# Altium schematic sheet Mcu.SchDoc
size A3; SheetNumber: 4; SheetTotal: 5
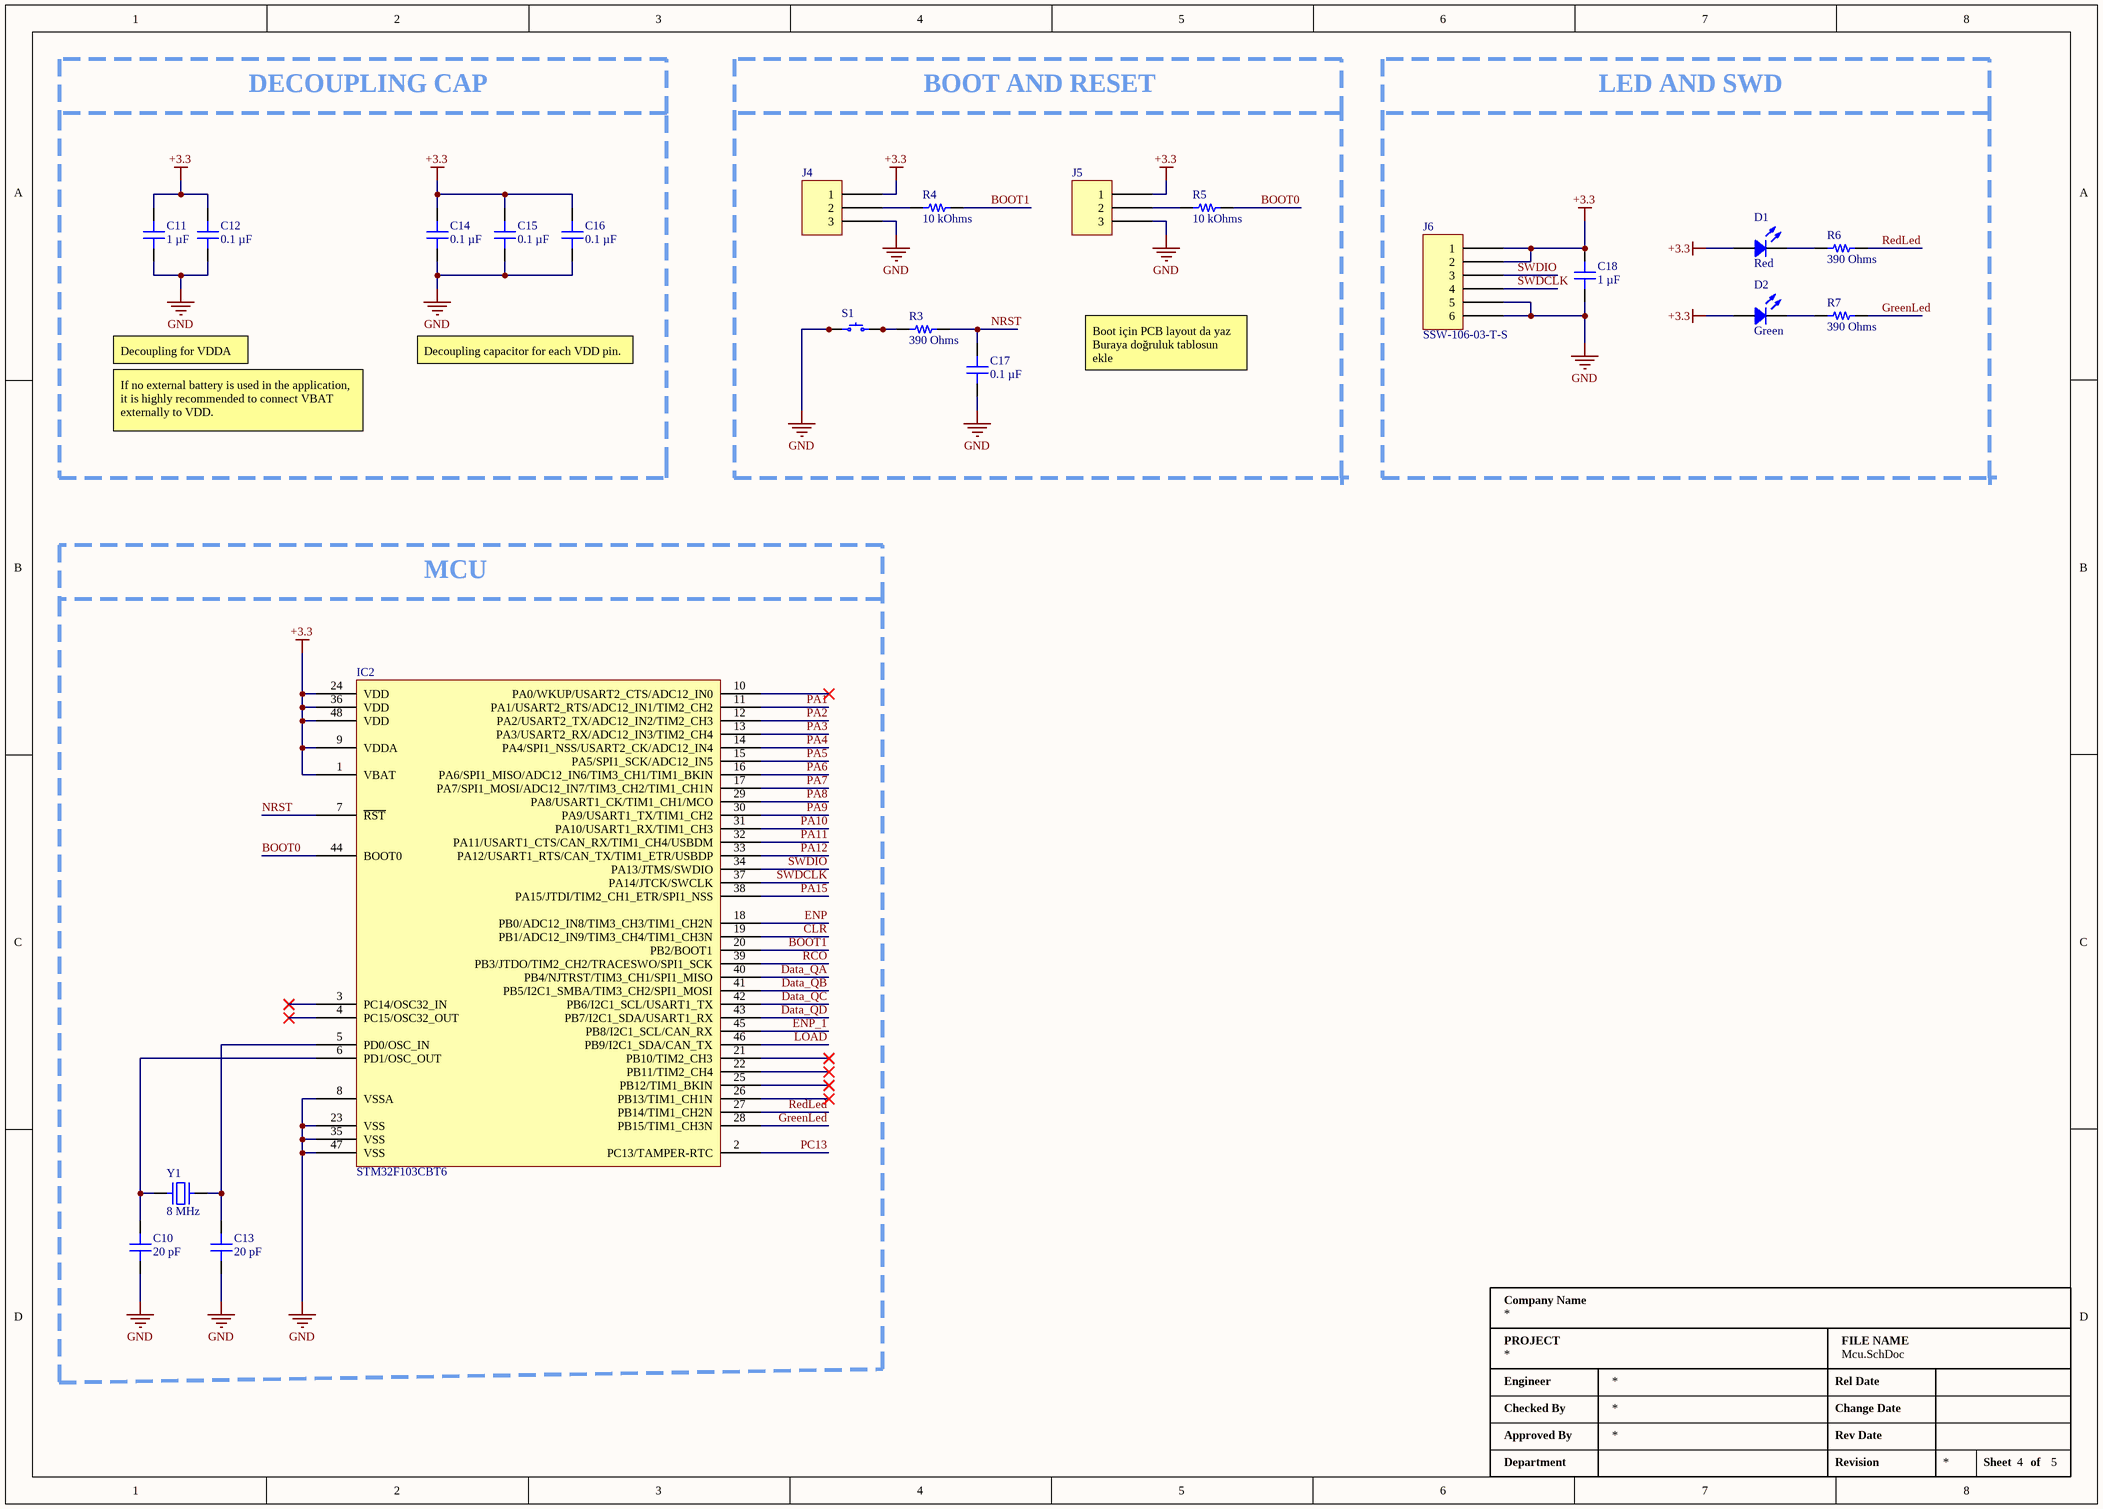
[diagram p0: Mcu.SchDoc]

## Parts
C10  20 pF  [CAP 0805_2012]
C11  1 µF  [CAP 0603_1608]
C12  0.1 µF  [CAP 0805_2012]
C13  20 pF  [CAP 0805_2012]
C14  0.1 µF  [CAP 0805_2012]
C15  0.1 µF  [CAP 0805_2012]
C16  0.1 µF  [CAP 0805_2012]
C17  0.1 µF  [CAP 0805_2012]
C18  1 µF  [CAP 0603_1608]
D1  Red  [LED 0805_2012 RED]
D2  Green  [LED 0805_2012 RED]
IC2  STM32F103CBT6  [ST LQFP-48 7X7MM]
J4  61300311121  [WURTH WE-PHD 61300311121]  (value not drawn)
J5  61300311121  [WURTH WE-PHD 61300311121]  (value not drawn)
J6  SSW-106-03-T-S  [SAMTEC SSW-106-03-T-S]
R3  390 Ohms  [KOA RES RK73 RN73 0603_1608]
R4  10 kOhms  [YAGEO RES 0603_1608]
R5  10 kOhms  [YAGEO RES 0603_1608]
R6  390 Ohms  [KOA RES RK73 RN73 0603_1608]
R7  390 Ohms  [KOA RES RK73 RN73 0603_1608]
S1  PTS645SM43SMTR92 LFS  [C&K PTS645]  (value not drawn)
Y1  8 MHz  [NDK NX5032GA]

## Blocks framed on the sheet
DECOUPLING CAP: C11 C12 C14-C16
MCU: C10 C13 IC2 Y1

## Nets
+3.3: C11.2 C12.2 C14.2 C15.2 C16.2 C18.2 D1.1 D2.1 IC2.1(VBAT) IC2.9(VDDA) IC2.24(VDD) IC2.36(VDD) IC2.48(VDD) J4.1 J5.1 J6.1 J6.2
GND: C10.1 C11.1 C12.1 C13.1 C14.1 C15.1 C16.1 C17.2 C18.1 IC2.8(VSSA) IC2.23(VSS) IC2.35(VSS) IC2.47(VSS) J4.3 J5.3 J6.5 J6.6 S1.1 S1.2
BOOT0: IC2.44(BOOT0) R5.2
BOOT1: IC2.20(PB2/BOOT1) R4.2
CLR: IC2.19(PB1/ADC12_IN9/TIM3_CH4/TIM1_CH3N)
Data_QA: IC2.40(PB4/NJTRST/TIM3_CH1/SPI1_MISO)
Data_QB: IC2.41(PB5/I2C1_SMBA/TIM3_CH2/SPI1_MOSI)
Data_QC: IC2.42(PB6/I2C1_SCL/USART1_TX)
Data_QD: IC2.43(PB7/I2C1_SDA/USART1_RX)
ENP: IC2.18(PB0/ADC12_IN8/TIM3_CH3/TIM1_CH2N)
ENP_1: IC2.45(PB8/I2C1_SCL/CAN_RX)
GreenLed: IC2.28(PB15/TIM1_CH3N) R7.1
LOAD: IC2.46(PB9/I2C1_SDA/CAN_TX)
NRST: C17.1 IC2.7(~{RST}) R3.2
PA1: IC2.11(PA1/USART2_RTS/ADC12_IN1/TIM2_CH2)
PA2: IC2.12(PA2/USART2_TX/ADC12_IN2/TIM2_CH3)
PA3: IC2.13(PA3/USART2_RX/ADC12_IN3/TIM2_CH4)
PA4: IC2.14(PA4/SPI1_NSS/USART2_CK/ADC12_IN4)
PA5: IC2.15(PA5/SPI1_SCK/ADC12_IN5)
PA6: IC2.16(PA6/SPI1_MISO/ADC12_IN6/TIM3_CH1/TIM1_BKIN)
PA7: IC2.17(PA7/SPI1_MOSI/ADC12_IN7/TIM3_CH2/TIM1_CH1N)
PA8: IC2.29(PA8/USART1_CK/TIM1_CH1/MCO)
PA9: IC2.30(PA9/USART1_TX/TIM1_CH2)
PA10: IC2.31(PA10/USART1_RX/TIM1_CH3)
PA11: IC2.32(PA11/USART1_CTS/CAN_RX/TIM1_CH4/USBDM)
PA12: IC2.33(PA12/USART1_RTS/CAN_TX/TIM1_ETR/USBDP)
PA15: IC2.38(PA15/JTDI/TIM2_CH1_ETR/SPI1_NSS)
PC13: IC2.2(PC13/TAMPER-RTC)
RCO: IC2.39(PB3/JTDO/TIM2_CH2/TRACESWO/SPI1_SCK)
RedLed: IC2.27(PB14/TIM1_CH2N) R6.1
SWDCLK: IC2.37(PA14/JTCK/SWCLK) J6.4
SWDIO: IC2.34(PA13/JTMS/SWDIO) J6.3
NetC10_2: C10.2 IC2.6(PD1/OSC_OUT) Y1.2
NetC13_2: C13.2 IC2.5(PD0/OSC_IN) Y1.1
NetD1_2: D1.2 R6.2
NetD2_2: D2.2 R7.2
NetJ4_2: J4.2 R4.1
NetJ5_2: J5.2 R5.1
NetR3_1: R3.1 S1.3 S1.4

Not connected (* = marked no-connect by the designer): IC2 3(PC14/OSC32_IN)* 4(PC15/OSC32_OUT)* 10(PA0/WKUP/USART2_CTS/ADC12_IN0)* 21(PB10/TIM2_CH3)* 22(PB11/TIM2_CH4)* 25(PB12/TIM1_BKIN)* 26(PB13/TIM1_CH1N)*

## Notes on the sheet
- BOOT AND RESET
- LED AND SWD
- Decoupling for VDDA
- Decoupling capacitor for each VDD pin.
- Boot için PCB layout da yaz
  Buraya doğruluk tablosun ekle
- If no external battery is used in the application, it is highly recommended to connect VBAT
  externally to VDD.
- Company Name
- Engineer
- PROJECT
- Rel Date
- FILE NAME
- Checked By
- Approved By
- Rev Date
- Change Date
- Department
- Revision
- Sheet
- of

## Library data of the parts
C10 C13 = C0805C200F5GAC7800: CAP CER SMD 0805 20PF 50V 1% COG; manufacturer: KEMET; Temperature Coefficient: C0G, NP0; Part Number: C0805C200F5GAC7800; Capacitance: 20 pF; Applications: General Purpose; componentlink1description: Datasheet; componentlink1url: https://api.kemet.com/component-edge/download/datasheet/C0805C200F5GAC7800.pdf; componentlink2description: DigiKey Link; componentlink2url: https://www.digikey.com/en/products/detail/kemet/C0805C200F5GAC7800/8572458; Device Package: 0805 (2012 Metric); Features: Low ESL; lastupdated: 9.02.2024 20:15:38; Lifecycle Status: Active; Minimum Order: 1; Mounting Type: Surface Mount, MLCC; Operating Temperature: -55°C ~ 125°C; Package / Case: 0805 (2012 Metric); packaging: TapeAndReel; partid: 13880; Part Status: Active; price: 0.32; series: SMD Comm C0G; Size / Dimension: 0.079" L x 0.049" W (2.00mm x 1.25mm); Supplier 1: DigiKey; Supplier Part Number 1: 399-17623-1-ND; Thickness (Max): 0.035" (0.88mm); Tolerance: ±1%; value: 20 pF; Voltage - Rated: 50V
C11 C18 = C0603X105M4RAC7867: CAP CER 0603 1UF 16V X7R 20%; manufacturer: KEMET; Part Number: C0603X105M4RAC7867; Capacitance: 1 µF; Applications: Boardflex Sensitive; componentlink1description: Datasheet; componentlink1url: https://api.kemet.com/component-edge/download/datasheet/C0603X105M4RAC7867.pdf; componentlink2description: DigiKey Link; componentlink2url: https://www.digikey.com/en/products/detail/kemet/C0603X105M4RAC7867/8635843; Device Package: 0603 (1608 Metric); Features: Soft Termination; lastupdated: 9.02.2024 20:10:28; Lifecycle Status: Active; Minimum Order: 1; Mounting Type: Surface Mount, MLCC; Operating Temperature: -55°C ~ 125°C; Package / Case: 0603 (1608 Metric); packaging: TapeAndReel; partid: 3937; Part Status: Active; price: 0.05; series: SMD Comm X7R Flex; Size / Dimension: 0.063" L x 0.031" W (1.60mm x 0.80mm); Supplier 1: DigiKey; Supplier Part Number 1: 399-17716-1-ND; Temperature Coefficient: X7R; Thickness (Max): 0.037" (0.95mm); Tolerance: ±20%; value: 1 µF; Voltage - Rated: 16V
C12 C14-C17 = C0805C104J1RECAUTO: CAP CER 0805 0.1UF 100V X7R 5%; manufacturer: KEMET; Part Number: C0805C104J1RECAUTO; Capacitance: 0.1 µF; Applications: Automotive, ESD Protection; componentlink1description: Datasheet; componentlink1url: https://api.kemet.com/component-edge/download/datasheet/C0805C104J1RECAUTO.pdf; componentlink2description: DigiKey Link; componentlink2url: https://www.digikey.com/en/products/detail/kemet/C0805C104J1RECAUTO/8646637; Device Package: 0805 (2012 Metric); lastupdated: 9.02.2024 20:15:06; Lifecycle Status: Active; Minimum Order: 1; Mounting Type: Surface Mount, MLCC; Operating Temperature: -55°C ~ 125°C; Package / Case: 0805 (2012 Metric); packaging: TapeAndReel; partid: 31979; Part Status: Active; price: 0.05; Ratings: AEC-Q200; series: ESD SMD Auto X7R; Size / Dimension: 0.079" L x 0.049" W (2.00mm x 1.25mm); Supplier 1: DigiKey; Supplier Part Number 1: 399-C0805C104J1RECAUTOCT-ND; Temperature Coefficient: X7R; Thickness (Max): 0.043" (1.10mm); Tolerance: ±5%; value: 0.1 µF; Voltage - Rated: 100V
D1 D2 = CMD17-21SRC/TR8: LED RED CLEAR 0805 SMD; Manufacturer: Visual Communications Company - VCC; Configuration: Standard; Current - Test: 20mA; Lens Color: Colorless; Lens Size: 1.40mm x 1.25mm; Lens Style: Rectangle with Flat Top; Millicandela Rating: 21mcd; Viewing Angle: 140°; Voltage - Forward (Vf) (Typ): 1.7V; Wavelength - Peak: 660nm; Part Number: CMD17-21SRC/TR8; Color: Red; ComponentLink1Description: Datasheet; ComponentLink1URL: https://vcclite.com/wp-content/uploads/wpallimport/files/files/CMD1721Seriesver3.pdf; ComponentLink2Description: DigiKey Link; ComponentLink2URL: https://www.digikey.com/en/products/detail/visual-communications-company-vcc/CMD17-21SRC-TR8/254848; Device Package: 0805 (2012 Metric); Height (Max): 1.20mm; LastUpdated: 3.06.2024 20:00:06; Lens Transparency: Clear; Lifecycle Status: Active; Minimum Order: 1; Mounting Type: Surface Mount; Package / Case: 0805 (2012 Metric); Packaging: TapeAndReel; PartId: 369; Part Status: Active; Price: 0.30; Series: CMD17-21; Size / Dimension: 2.00mm L x 1.25mm W; Supplier 1: DigiKey; Supplier Part Number 1: L62411CT-ND; Supplier Device Package: 0805
  D1: Value: Red
  D2: Value: Green
IC2 = STM32F103CBT6: IC MCU 32BIT 128KB FLASH 48LQFP; Manufacturer: STMicroelectronics; Connectivity: CANbus, I²C, IrDA, LINbus, SPI, UART/USART, USB; Core Processor: ARM® Cortex®-M3; Core Size: 32-Bit; Data Converters: A/D 10x12b; Number of I/O: 37; Oscillator Type: Internal; Peripherals: DMA, Motor Control PWM, PDR, POR, PVD, PWM, Temp Sensor, WDT; Program Memory Size: 128KB (128K x 8); RAM Size: 20K x 8; Speed: 72MHz; Voltage - Supply (Vcc/Vdd): 2V ~ 3.6V; Part Number: STM32F103CBT6; ComponentLink1Description: Datasheet; ComponentLink1URL: https://www.st.com/resource/en/datasheet/stm32f103cb.pdf; ComponentLink2Description: DigiKey Link; ComponentLink2URL: http://digikey.com/product-detail/en/stmicroelectronics/STM32F103CBT6/497-6288-ND/1754420; Device Package: 48-LQFP; LastUpdated: 24.05.2020 22:49:18; Lifecycle Status: Active; Minimum Order: 1; Mounting Type: Surface Mount; Operating Temperature: -40°C ~ 85°C (TA); Package / Case: 48-LQFP; Packaging: Tray; PartId: 194; Part Status: Active; Price: 5.25; Program Memory Type: FLASH; Series: STM32F1; Supplier 1: DigiKey; Supplier Part Number 1: 497-6288-ND
J4 J5 = 61300311121: CONN HEADER VERT 3POS 2.54MM; Manufacturer: Würth Elektronik; Contact Length - Mating: 0.236" (6.00mm); Contact Length - Post: 0.118" (3.00mm); Current Rating (Amps): 3A; Material Flammability Rating: UL94 V-0; Number of Positions: 3; Number of Positions Loaded: All; Overall Contact Length: 0.454" (11.54mm); Pitch - Mating: 0.100" (2.54mm); Row Spacing - Mating: -40°C ~ 105°C; Shrouding: Unshrouded; Style: Board to Board or Cable; Part Number: 61300311121; ComponentLink1Description: Datasheet; ComponentLink1URL: https://katalog.we-online.de/em/datasheet/6130xx11121.pdf; ComponentLink2Description: DigiKey Link; ComponentLink2URL: https://www.digikey.com/en/products/detail/würth-elektronik/61300311121/4846825; Connector Type: Header; Contact Finish - Mating: Gold; Contact Material: Copper Alloy; Contact Shape: Square; Contact Type: Male Pin; Fastening Type: Push-Pull; Insulation Color: Black; Insulation Height: 0.100" (2.54mm); Insulation Material: Polyamide (PA6T), Nylon 6T; LastUpdated: 18.10.2024 13:43:15; Lifecycle Status: Active; Minimum Order: 1; Mounting Type: Through Hole; Number of Rows: 1; Operating Temperature: -40°C ~ 105°C; Packaging: Bulk; PartId: 189; Part Status: Active; Price: 0.07; Series: WR-PHD; Supplier 1: DigiKey; Supplier Part Number 1: 732-5316-ND; Termination: Solder
J6 = SSW-106-03-T-S: CONN RCPT 6POS 0.1 TIN PCB; Manufacturer: Samtec Inc.; Connector Type: Receptacle; Contact Length - Post: 0.394" (10.00mm); Current Rating (Amps): 5.7A per Contact; Material Flammability Rating: UL94 V-0; Number of Positions: 6; Number of Positions Loaded: All; Pitch - Mating: 0.100" (2.54mm); Style: Board to Board or Cable; Part Number: SSW-106-03-T-S; ComponentLink1Description: Datasheet; ComponentLink1URL: http://suddendocs.samtec.com/prints/ssw-s.pdf; ComponentLink2Description: DigiKey Link; ComponentLink2URL: https://www.digikey.com/en/products/detail/samtec-inc/SSW-106-03-T-S/1790202; Contact Finish - Mating: Tin; Contact Finish - Post: Tin; Contact Type: Forked; Fastening Type: Push-Pull; Insulation Color: Black; Insulation Height: 0.335" (8.51mm); LastUpdated: 21.06.2022 15:09:22; Lifecycle Status: Active; Minimum Order: 1; Mounting Type: Through Hole; Number of Rows: 1; Operating Temperature: -55°C ~ 105°C; Packaging: Bulk; Part Status: Active; Price: 0.55; Series: SSW; Supplier 1: DigiKey; Supplier Part Number 1: SAM8865-ND; Termination: Solder
R3 R6 R7 = RK73B1JTTDD391J: RESISTOR; Manufacturer: KOA Speer Electronics, Inc.; Power (Watts): 0.125W, 1/8W; Temperature Coefficient: ±200ppm/°C; Tolerance: ±5%; Part Number: RK73B1JTTDD391J; Value: 390 Ohms; ComponentLink1Description: Datasheet; ComponentLink1URL: https://www.koaspeer.com/pdfs/RK73B.pdf; ComponentLink2Description: DigiKey Link; ComponentLink2URL: https://www.digikey.com/en/products/detail/koa-speer-electronics-inc/RK73B1JTTDD391J/21679924; Composition: Thick Film; Device Package: 0603 (1608 Metric); Features: Automotive AEC-Q200; Height - Seated (Max): 0.022" (0.55mm); LastUpdated: 25.07.2024 09:42:51; Lifecycle Status: Active; Minimum Order: 1; Number of Terminations: 2; Operating Temperature: -55°C ~ 155°C; Package / Case: 0603 (1608 Metric); Packaging: CutTape; PartId: 89761; Price: 0.01; Ratings: AEC-Q200; Resistance: 390 Ohms; Series: RK73B; Size / Dimension: 0.063" L x 0.031" W (1.60mm x 0.80mm); Supplier 1: DigiKey; Supplier Part Number 1: 2019-RK73B1JTTDD391JCT-ND; Supplier Device Package: 0603
R4 R5 = AT0603FRE0710KL: RES SMD 10K OHM 1% 1/10W 0603; Manufacturer: Yageo; Power (Watts): 0.1W, 1/10W; Temperature Coefficient: ±50ppm/°C; Part Number: AT0603FRE0710KL; Value: 10 kOhms; ComponentLink1Description: Datasheet; ComponentLink1URL: http://www.yageo.com/documents/recent/PYu-AT_51_RoHS_L_5.pdf; ComponentLink2Description: DigiKey Link; ComponentLink2URL: https://www.digikey.com/en/products/detail/yageo/AT0603FRE0710KL/5138641; Composition: Thin Film; Device Package: 0603 (1608 Metric); Features: Anti-Sulfur, Automotive AEC-Q200, Moisture Resistant; Height - Seated (Max): 0.022" (0.55mm); LastUpdated: 25.07.2024 09:19:22; Lifecycle Status: Active; Minimum Order: 1; Number of Terminations: 2; Operating Temperature: -55°C ~ 155°C; Package / Case: 0603 (1608 Metric); Packaging: TapeAndReel; PartId: 18757; Part Status: Active; Price: 0.02; Ratings: AEC-Q200; Resistance: 10 kOhms; Series: AT; Size / Dimension: 0.063" L x 0.031" W (1.60mm x 0.80mm); Supplier 1: DigiKey; Supplier Part Number 1: YAG2122CT-ND; Supplier Device Package: 0603; Tolerance: ±1%
S1 = PTS645SM43SMTR92 LFS: SWITCH TACTILE SPST-NO 0.05A 12V; Manufacturer: C&K; Actuator Height off PCB, Vertical: 4.30mm; Actuator Orientation: Top Actuated; Actuator Type: Standard; Contact Rating @ Voltage: 0.05A @ 12VDC; Illumination: Non-Illuminated; Operating Force: 160gf; Outline: 6.00mm x 6.00mm; Switch Function: Off-Mom; Part Number: PTS645SM43SMTR92 LFS; Circuit: SPST-NO; ComponentLink1Description: Datasheet; ComponentLink1URL: https://dznh3ojzb2azq.cloudfront.net/products/Tactile/PTS645/documents/datasheet.pdf; ComponentLink2Description: DigiKey Link; ComponentLink2URL: http://digikey.com/product-detail/en/c-k/PTS645SM43SMTR92-LFS/CKN9112CT-ND/1146934; Features: Blue Actuator; LastUpdated: 9.04.2020 09:59:00; Lifecycle Status: Active; Minimum Order: 1; Mounting Type: Surface Mount; Operating Temperature: -20°C ~ 60°C; Packaging: TapeAndReel; Part Status: Active; Price: 0.09; Series: PTS645; Supplier 1: DigiKey; Supplier Part Number 1: CKN9112CT-ND; Termination Style: Gull Wing
Y1 = NX5032GA-8MHZ-EXS00A-CG07039: CRYSTAL 8.0000MHZ 18PF SMD; Manufacturer: NDK America, Inc.; ESR (Equivalent Series Resistance): 300 Ohms; Frequency Stability: ±30ppm; Frequency Tolerance: ±20ppm; Operating Mode: Fundamental; Part Number: NX5032GA-8MHZ-EXS00A-CG07039; ComponentLink1Description: Datasheet; ComponentLink1URL: //media.digikey.com/pdf/Data%20Sheets/NDK%20PDFs/NX5032GA-8MHz-EXS00A-CG07039.pdf; ComponentLink2Description: DigiKey Link; ComponentLink2URL: https://www.digikey.com/en/products/detail/ndk-america-inc/NX5032GA-8MHZ-EXS00A-CG07039/8275423; Frequency: 8 MHz; Height - Seated (Max): 0.059" (1.50mm); LastUpdated: 3.06.2024 20:02:22; Lifecycle Status: Active; Load Capacitance: 18pF; Minimum Order: 1; Mounting Type: Surface Mount; Operating Temperature: -40°C ~ 85°C; Package / Case: 2-SMD, No Lead; Packaging: TapeAndReel; PartId: 609; Part Status: Active; Price: 0.32; Series: NX5032GA; Size / Dimension: 0.197" L x 0.126" W (5.00mm x 3.20mm); Supplier 1: DigiKey; Supplier Part Number 1: 644-1318-1-ND; Type: MHz Crystal; Value: 8 MHz